# Altium schematic sheet Power.SchDoc
size A; SheetNumber: 2; SheetTotal: 9
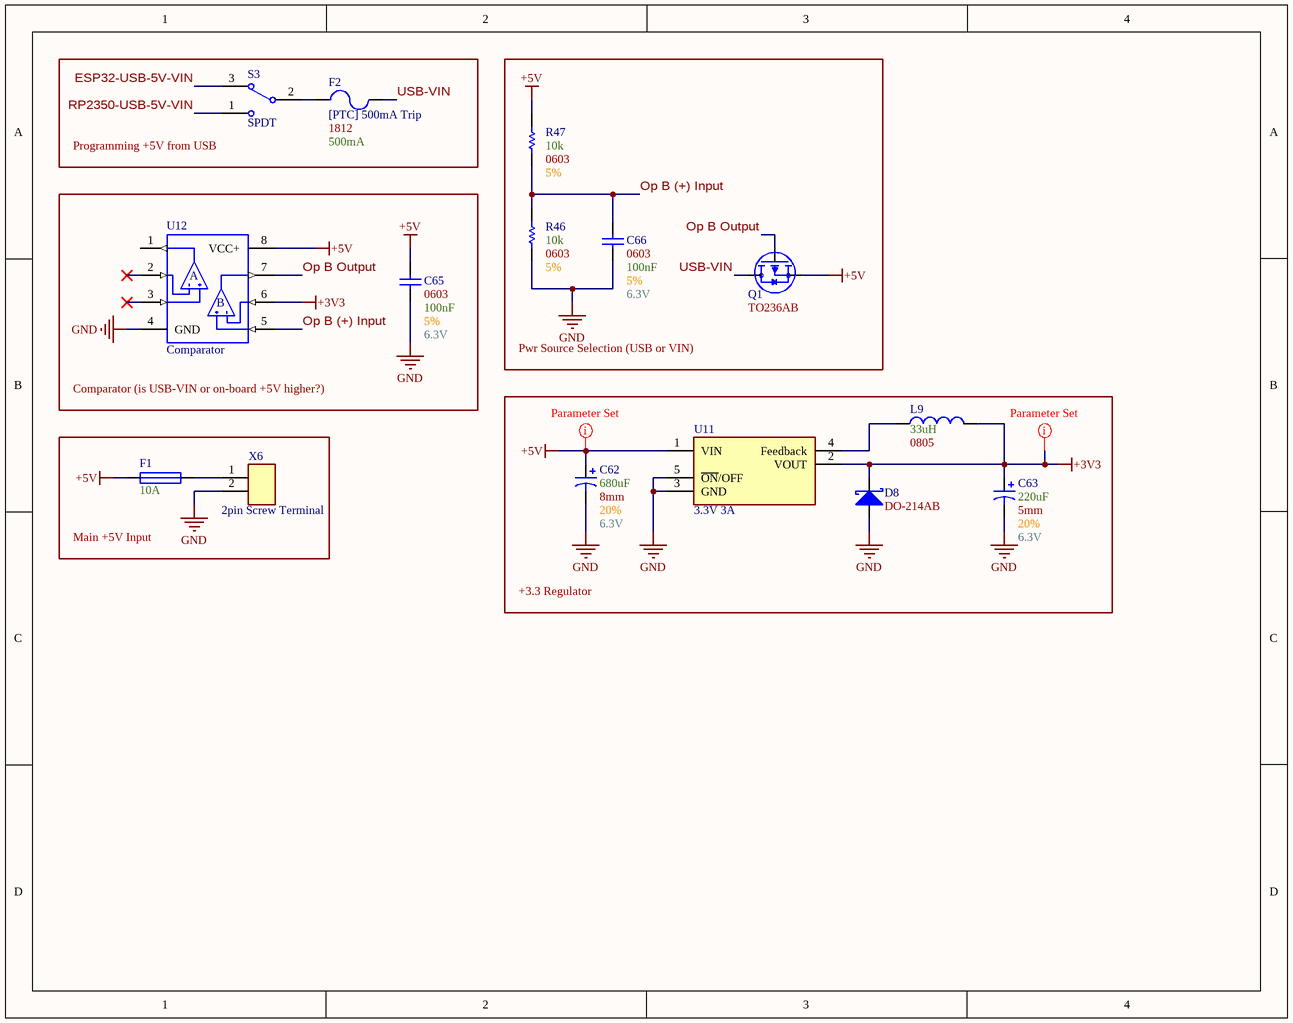
[diagram p0: Power.SchDoc]

## Parts
C62  Tolerance: 20%  Max Voltage: 6.3V  Capacitance: 680uF  Diameter: 8mm  [[Cap] SMD Polarized, 8mm]  (hidden comment: SMD Polarized)
C63  Tolerance: 20%  Max Voltage: 6.3V  Capacitance: 220uF  Diameter: 5mm  [[Cap] SMD Polarized, 5mm]  (hidden comment: SMD Polarized)
C65  Size Package: 0603  Capacitance: 100nF  Voltage: 6.3V  Tolerance: 5%  [[Cap] SMD 0603]  (hidden comment: [Cap] SMD Nonpolarized)
C66  Size Package: 0603  Capacitance: 100nF  Voltage: 6.3V  Tolerance: 5%  [[Cap] SMD 0603]  (hidden comment: [Cap] SMD Nonpolarized)
D8  Size Package: DO-214AB  [[Diode] SMD DO-214AB]  (hidden comment: Schottky)
F1  Amperage: 10A  [[Fuse] Blade Right-Angle]  (hidden comment: Right-Angle)
F2  [PTC] 500mA Trip  Size Package: 1812  Trip Current: 500mA  [[PTC] 500mA Trip]
L9  Size Package: 0805  Inductance: 33uH  [[Inductor] SMD 0805]  (hidden comment: SMD Inductor)
Q1  Size Package: TO236AB  [[FET] P-Channel Mosfet]  (hidden comment: PMV48XP)
R46  Resistance: 10k  Size Package: 0603  Tolerance: 5%  [[Res] SMD 0603]  (hidden comment: [Res] SMD Resistor)
R47  Resistance: 10k  Size Package: 0603  Tolerance: 5%  [[Res] SMD 0603]  (hidden comment: [Res] SMD Resistor)
S3  SPDT  [[Switch] SPDT]
U11  3.3V 3A  [[Reg] 3V3 Regulator (4)]
U12  Comparator  [[IC] Dual Op-Ap]
X6  2pin Screw Terminal  [[Screw Terminal] 2pin 5mm]

## Blocks framed on the sheet
Programming +5V from USB: F2 S3
Pwr Source Selection (USB or VIN): C66 Q1 R46 R47
Comparator (is USB-VIN or on-board +5V higher?): C65 U12
+3.3 Regulator: C62 C63 D8 L9 U11
Main +5V Input: F1 X6

## Nets
+3V3: C63.1 D8.1(K) L9.2 U11.2(VOUT) U12.6(2IN-)
+5V: C62.1 C65.2 F1.1 Q1.2(S) R47.2 U11.1(VIN) U12.8(VCC+)
GND: C62.2 C63.2 C65.1 C66.1 D8.2(A) R46.1 U11.3(GND) U11.5(~{ON}/OFF) U12.4(GND) X6.2
ESP32-USB-5V-VIN: S3.3
Op B (+) Input: C66.2 R46.2 R47.1 U12.5(2IN+)
Op B Output: Q1.1(G) U12.7(2OUT)
RP2350-USB-5V-VIN: S3.1
USB-VIN: F2.2 Q1.3(D)
NetF1_2: F1.2 X6.1
NetF2_1: F2.1 S3.2
NetL9_1: L9.1 U11.4(Feedback)

Not connected (* = marked no-connect by the designer): U12 1(1OUT) 2(1IN-)* 3(1IN+)*

## Layout directives
net class Supply_Nets: +3V3, +5V

## Notes on the sheet
- (in symbol [IC] Dual Op-Amp) A; B

## Library data of the parts
C62 C63 = [Cap] SMD Polarized: Supplier 1: DigiKey
  C62: Supplier Part Number 1: PCE3781CT-ND
  C63: Supplier Part Number 1: 493-17593-1-ND
D8 = [Diode] SMD Schottky: Generic; Supplier 1: DigiKey; Supplier Part Number 1: B530C-FDICT-ND
F1 = [Fuse] Blade Right-Angle: Supplier 1: DigiKey; Supplier Part Number 1: 36-3549-2-ND
F2 = [PTC] 500mA Trip: MF-MSMF050-2; Supplier 1: DigiKey; Supplier Part Number 1: MF-MSMF050-2DKR-ND
L9 = [Inductor] SMD Inductor: JLC Part #: *; Mouser Part #: *; Supplier 1: DigiKey; Supplier Part Number 1: 445-6399-1-ND
Q1 = [FET] P-Channel MOSFET: Supplier 1: DigiKey; Supplier Part Number 1: 1727-PMV48XPA2RCT-ND
R46 R47 = [Res] SMD Resistor: Generic; Supplier 1: DigiKey; Supplier Part Number 1: 311-10.0KHRDKR-ND
S3 = [Switch] SPDT Switch: Supplier 1: DigiKey; Supplier Part Number 1: 1948-1087-ND
U11 = [Reg] 3V3 Regulator (4): 3A; Supplier 1: DigiKey; Supplier Part Number 1: LM2596SX-3.3/NOPBCT-ND
U12 = [IC] Dual Op-Amp: LMV358IDGKR; Supplier 1: DigiKey; Supplier Part Number 1: 296-13455-1-ND
X6 = [Screw Terminal] 2pin: Supplier 1: DigiKey; Supplier Part Number 1: 102-6145-ND
C65 C66 = [Cap] SMD Nonpolarized: Supplier 1: DigiKey; Supplier Part Number 1: 311-1088-6-ND